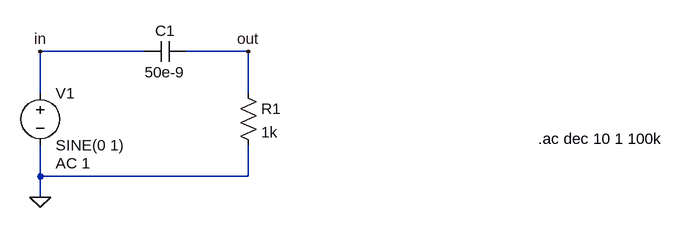
[diagram p0: schematic rc_circuit.asc]
rc_circuit.asc, the LTspice schematic file:
Version 4
SHEET 1 880 680
WIRE -48 112 -208 112
WIRE 112 112 16 112
WIRE -208 176 -208 112
WIRE 112 176 112 112
WIRE -208 304 -208 256
WIRE 112 304 112 256
WIRE 112 304 -208 304
WIRE -208 336 -208 304
FLAG -208 336 0
FLAG 112 112 out
FLAG -208 112 in
SYMBOL cap 16 96 R90
WINDOW 0 0 32 VBottom 2
WINDOW 3 32 32 VTop 2
SYMATTR InstName C1
SYMATTR Value 50e-9
SYMBOL res 96 160 R0
SYMATTR InstName R1
SYMATTR Value 1k
SYMBOL voltage -208 160 R0
WINDOW 123 24 124 Left 2
WINDOW 39 0 0 Left 0
SYMATTR InstName V1
SYMATTR Value SINE(0 1)
SYMATTR Value2 AC 1
TEXT 558 246 Left 2 !.ac dec 10 1 100k

The netlist it stands for:
* rc_circuit.asc
C1 out in 50e-9
R1 out 0 1k
V1 in 0 SINE(0 1) AC 1
.ac dec 10 1 100k
.backanno
.end